# Altium schematic sheet ENCODERTESTINGSch.SchDoc
size A4; SheetNumber: 1; SheetTotal: 1
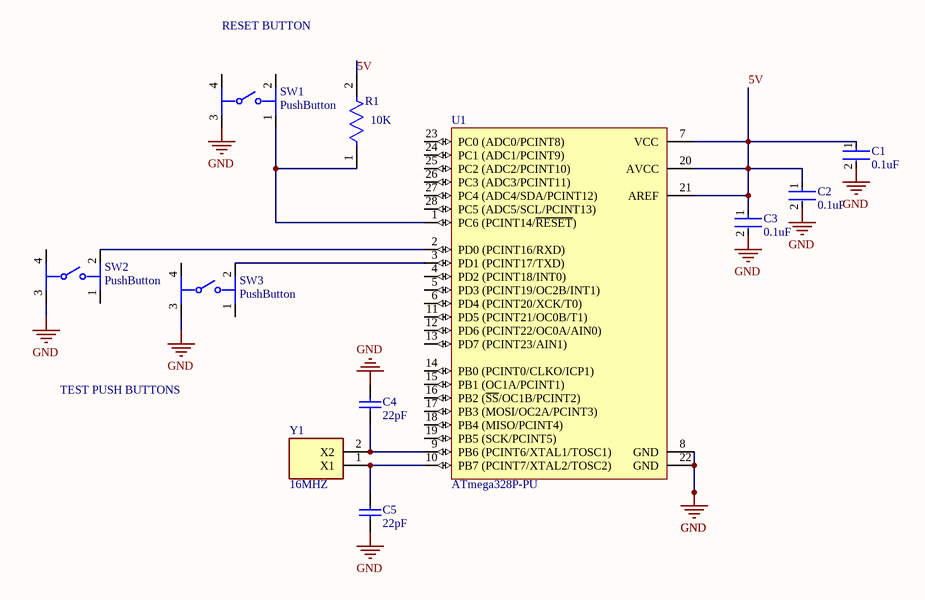
[diagram p0: ENCODERTESTINGSch.SchDoc]

## Parts
C1  0.1uF  [FP-K15H5-MFG]
C2  0.1uF  [FP-K15H5-MFG]
C3  0.1uF  [FP-K15H5-MFG]
C4  22pF  [KEMT-C315-THT-2]
C5  22pF  [KEMT-C315-THT-2]
R1  10K  [FP-CRCW2512-e3-IPC_A]
SW1  PushButton  [FP-FSM103-MFG]
SW2  PushButton  [FP-FSM103-MFG]
SW3  PushButton  [FP-FSM103-MFG]
U1  ATmega328P-PU  [28P3]
Y1  16MHZ  [ABL16000MHZB2]

## Nets
GND: C1.2 C2.2 C3.2 C4.2 C5.1 SW1.3 SW2.3 SW3.3 U1.8(GND) U1.22(GND)
5V: C1.1 C2.1 C3.1 R1.2 U1.7(VCC) U1.20(AVCC) U1.21(AREF)
NetC4_1: C4.1 U1.9(PB6_(PCINT6/XTAL1/TOSC1)) Y1.2(X2)
NetC5_2: C5.2 U1.10(PB7_(PCINT7/XTAL2/TOSC2)) Y1.1(X1)
NetR1_1: R1.1 SW1.1 U1.1(PC6_(PCINT14/~{RESET}))
NetSW2_2: SW2.2 U1.2(PD0_(PCINT16/RXD))
NetSW3_2: SW3.2 U1.3(PD1_(PCINT17/TXD))

Not connected (* = marked no-connect by the designer): SW1 2 4; SW2 1 4; SW3 1 4; U1 4(PD2_(PCINT18/INT0)) 5(PD3_(PCINT19/OC2B/INT1)) 6(PD4_(PCINT20/XCK/T0)) 11(PD5_(PCINT21/OC0B/T1)) 12(PD6_(PCINT22/OC0A/AIN0)) 13(PD7_(PCINT23/AIN1)) 14(PB0_(PCINT0/CLKO/ICP1)) 15(PB1_(OC1A/PCINT1)) 16(PB2_(~{SS}/OC1B/PCINT2)) 17(PB3_(MOSI/OC2A/PCINT3)) 18(PB4_(MISO/PCINT4)) 19(PB5_(SCK/PCINT5)) 23(PC0_(ADC0/PCINT8)) 24(PC1_(ADC1/PCINT9)) 25(PC2_(ADC2/PCINT10)) 26(PC3_(ADC3/PCINT11)) 27(PC4_(ADC4/SDA/PCINT12)) 28(PC5_(ADC5/SCL/PCINT13))

## Notes on the sheet
- RESET BUTTON
- TEST PUSH BUTTONS

## Library data of the parts
C1-C3 = CMP-02417-000048-1: CAP CER 0.1UF 50V X7R RADIAL; Capacitance: 100nF; Tolerance: 10%; Lead/Base Style: Formed Leads; Lead Length: 30mm; Lead Diameter: 0.5mm; Radiation Hardening: No; Lead Pitch: 5mm; Voltage: 50V; Mount: Through Hole; Package Quantity: 5000; Series: K; Case/Package: Dipped; Min Operating Temperature: -55°C; Depth: 2.5mm; Height - Seated (Max): 0.1inch; Voltage Rating (DC): 50V; Packaging: Bulk; RoHS Compliant: Yes; Construction: RADIAL; Thickness: 2.6mm; Max Operating Temperature: 125°C; Voltage Rating: 50V; Diameter: 500um; Dielectric: X7R; Width: 2.5mm; Length: 4mm; Weight: 0.005644oz; Termination: Radial; Height: 4mm
C4 C5 = CMP-1664-00008-1: Capacitor, Ceramic, 22 pF, +/-10 %, 100 V, -55 to 125 degC, 2-Pin THD, RoHS, Bulk; Max Input Voltage: 40 V; Min Input Voltage: 4.2 V; Output Current: 1.5 A; Output Voltage: 1.2 V; Outputs: 1; Case\Package: TO-220; RoHSCompliant: true; Min Operating Temperature: 0 degC; Max Operating Temperature: 125 degC; Package Quantity: 50; ComponentLink2URL: http://capacitoredge.kemet.com/capedge2/DataSheet/Datasheet-C315C220K1G5TA.pdf?pn=C315C220K1G5TA{BULK}; Radiation Hardening: No; Pins: 3; Length: 10.28 mm; ComponentLink1URL: http://www.kemet.com/; ComponentLink2Description: Datasheet; Height: 9.28 mm; REACH SVHC: No SVHC; ComponentLink1Description: Manufacturer URL; Max Ouput Current: 1.5 A; Weight: 0.08113 oz; Packaging: Rail/Tube; DatasheetVersion: Aug-16; Mount: Through Hole; PackageReference: C315-THT-2; Width: 4.82 mm; PackageDescription: 2-Pin Through Hole Device, Body 3.81 x 2.54 mm
R1 = CMP-02407-002758-1: RES Thick Film, 10kΩ, 5%, 1W, 200ppm/°C, 2512; Resistance: 10kR; Voltage Rating: 500V; Termination: SMD/SMT; Weight: 0.001429oz; Number of Terminations: 2; Package Quantity: 1; Case/Package: 2512; Length: 6.3mm; Temperature Coefficient: 200ppm/°C; Packaging: Tape and Reel; Voltage Rating (DC): 500V; Case Code (Imperial): 2512; Max Operating Temperature: 155°C; Number of Pins: 2; Height: 0.028inch; Military Standard: Not; Lead Free: Lead Free; Min Operating Temperature: -55°C; Features: Automotive AEC-Q200; Contact Plating: Tin; Depth: 3.15mm; Mount: Surface Mount; REACH SVHC: No SVHC; Composition: Thick Film; Radiation Hardening: No; Max Power Dissipation: 1W; Case Code (Metric): 6432; Power Rating: 1W; Width: 0.124inch; Tolerance: 5%
SW1-SW3 = CMP-03407-000037-1: SWITCH TACTILE SPST-NO 0.05A 24V; Contact Resistance: 100mR; Actuator Length: 3.4mm; Switch Function: Off-Mom; Operating Force: 1.57N; Illumination Type: Non-Illuminated; Voltage Rating (DC): 12V; Current Rating: 50mA; Actuator Material: Polyester; Switch Travel: 0.3mm; Throw Configuration: SPST; Actuator Color: Black; Mechanical Life: 100000Cycles; Depth: 14.1mm; RoHS Compliant: Yes; Max Operating Temperature: 85°C; Mount: Through Hole; Min Operating Temperature: -35°C; Contact Plating: Silver; Width: 12mm; Package Quantity: 400; Radiation Hardening: No; Series: FSM100 ~ 104; Type: Switch; Termination: PC Pins; Voltage Rating: 24V; Contact Material: Brass; Max Voltage Rating (DC): 12V; Contact Current Rating: 50mA; Length: 12mm; Packaging: Loose Piece; Orientation: Straight; Max Current Rating: 50mA; Electrical Life: 100000Cycles
U1 = CMP-0095-00013-2: 8-bit AVR Microcontroller, 32KB Flash, 1KB EEPROM, 2KB SRAM, 28-pin PDIP, Industrial Grade (-40°C to 85°C); RevisionNote: DatasheetVersion updated. URLs added.; PackageVersion: revB, Sep-2001; PackageDescription: 28-lead (0.300"/7.62mm Wide) Plastic Dual Inline Package (PDIP); DatasheetVersion: revD, May-2011; ComponentLink1Description: Manufacturer URL; ComponentLink1URL: http://www.atmel.com/; PackageReference: 28P3; ComponentLink2Description: ATmega48A/48PA/88A/88PA/168A/168PA/328/328P Datasheet; ComponentLink3URL: http://www.atmel.com/dyn/resources/prod_documents/8271S.pdf; ComponentLink2URL: http://www.atmel.com/dyn/resources/prod_documents/8271.pdf; ComponentLink3Description: ATmega48A/48PA/88A/88PA/168A/168PA/328/328P Summary
Y1 = ABL-16.000MHZ-B2: Crystal or Oscillator; Manufacturer_Name: ABRACON; Datasheet Link: http://www.abracon.com/Resonators/ABL.pdf; Height: 3.5mm; Manufacturer_Part_Number: ABL-16.000MHZ-B2; Mouser Part Number: 815-ABL-16-B2; Mouser Price/Stock: https://www.mouser.co.uk/ProductDetail/ABRACON/ABL-16000MHZ-B2?qs=A7YjigRBFZlH19Ss3q%252BAbA%3D%3D; Arrow Part Number: ABL-16.000MHZ-B2; Arrow Price/Stock: https://www.arrow.com/en/products/abl-16.000mhz-b2/abracon